# Altium schematic sheet USB2UART.SchDoc
size A4
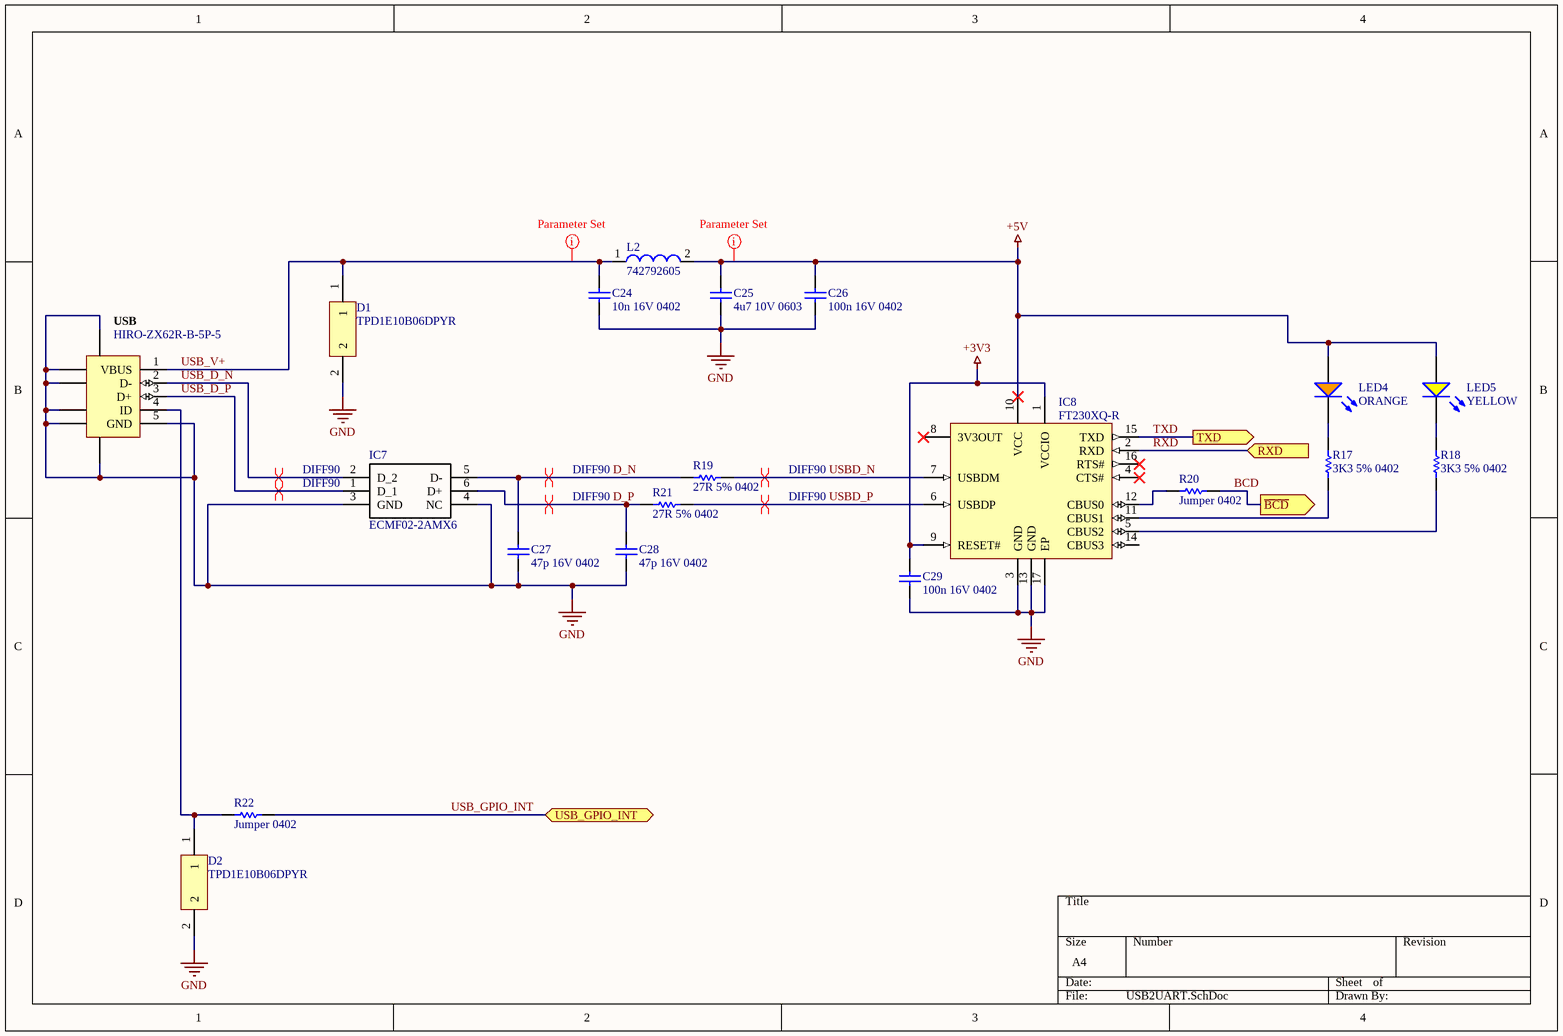
[diagram p0: USB2UART.SchDoc]

## Parts
C24  10n 16V 0402  [CAPC0402(1005)33_L]
C25  4u7 10V 0603  [CAPC0603(1608)100_L]
C26  100n 16V 0402  [CAPC0402(1005)60_L]
C27  47p 16V 0402  [CAPC0402(1005)60_L]
C28  47p 16V 0402  [CAPC0402(1005)60_L]
C29  100n 16V 0402  [CAPC0402(1005)60_N]
D1  TPD1E10B06DPYR  [DPY0002A_M]
D2  TPD1E10B06DPYR  [DPY0002A_M]
IC7  ECMF02-2AMX6  [SON50P150X170X55-6N-D]
IC8  FT230XQ-R  [QFN-16_L]
L2  742792605  [0603(1608)_L]
LED4  ORANGE  [LED_0402]
LED5  YELLOW  [LED_0402]
R17  3K3 5% 0402  [RESC0402(1005)_L]
R18  3K3 5% 0402  [RESC0402(1005)_L]
R19  27R 5% 0402  [RESC0402(1005)_L]
R20  Jumper 0402  [RESC0402(1005)_L]
R21  27R 5% 0402  [RESC0402(1005)_L]
R22  Jumper 0402  [RESC0402(1005)_L]
USB  HIRO-ZX62R-B-5P-5  [HIRO-ZX62R-B-5P_V]

## Ports
RXD (in), TXD (out), USB_GPIO_INT (bidir), ~{BCD} (out)

## Nets
+3V3: C29.2 IC8.1(VCCIO) IC8.9(RESET#)
+5V: C25.2 C26.2 IC8.10(VCC) L2.2 LED4.ANODE LED5.ANODE
GND: C24.1 C25.1 C26.1 C27.1 C28.1 C29.1 D1.2 D2.2 IC7.3(GND) IC7.4(NC) IC8.3(GND) IC8.13(GND) IC8.17(EP) USB.5(GND) USB.6(SHLD) USB.7(SHLD) USB.8(SHLD) USB.9(SHLD) USB.10(SHLD) USB.11(SHLD)
BCD: R20.2 ; port ~{BCD}
D_N: C27.2 IC7.5(D-) R19.1
D_P: C28.2 IC7.6(D+) R21.1
RXD: IC8.2(RXD) ; port RXD
TXD: IC8.15(TXD) ; port TXD
USB_D_N: IC7.2(D_2) USB.2(D-)
USB_D_P: IC7.1(D_1) USB.3(D+)
USB_GPIO_INT: R22.2 ; port USB_GPIO_INT
USB_V+: C24.2 D1.1 L2.1 USB.1(VBUS)
USBD_N: IC8.7(USBDM) R19.2
USBD_P: IC8.6(USBDP) R21.2
NetD2_1: D2.1 R22.1 USB.4(ID)
NetIC8_5: IC8.5(CBUS2) R18.1
NetIC8_11: IC8.11(CBUS1) R17.1
NetIC8_12: IC8.12(CBUS0) R20.1
NetLED4_CATHODE: LED4.CATHODE R17.2
NetLED5_CATHODE: LED5.CATHODE R18.2

Not connected (* = marked no-connect by the designer): IC8 4(CTS#)* 8(3V3OUT)* 14(CBUS3) 16(RTS#)*

## Layout directives
differential pair; net class DIFF90: D_N, D_P, USB_D_N, USB_D_P, USBD_N, USBD_P
rule Width Constraint [Pref Width = 0.254mm    Min Width = 0.254mm    Max Width = 0.5mm]: +5V, USB_V+

## Library data of the parts
C24 = CMP-1034-01875-1: CAP 10nF 16V ±10% 0402 (1005 Metric) Thickness 0.33mm SMD; Case-EIA: 0402; Tolerance: Â±10%; Case-Metric: 1005; Value: 10nF; Max Thickness: 0.33 mm; Rated Voltage: 16 V; Technology: SMT
C25 = CMP-1035-02787-1: CAP 4.7uF 10V ±20% 0603 (1608 Metric) Thickness 1mm SMD; Case-EIA: 0603; Case-Metric: 1608; Tolerance: Â±20%; Value: 4.7uF; Max Thickness: 1 mm; Technology: SMT; Rated Voltage: 10 V
C26 C29 = CMP-1034-02069-1: CAP 100nF 16V ±10% 0402 (1005 Metric) Thickness 0.6mm SMD; Case-EIA: 0402; Case-Metric: 1005; Tolerance: Â±10%; Value: 100nF; Max Thickness: 0.6 mm; Rated Voltage: 16 V; Technology: SMT
C27 C28 = CMP-1034-01081-1: CAP 47pF 16V ±10% 0402 (1005 Metric) Thickness 0.6mm SMD; Case-EIA: 0402; Case-Metric: 1005; Tolerance: Â±10%; Rated Voltage: 16 V; Technology: SMT; Value: 47pF; Max Thickness: 0.6 mm
D1 D2 = CMP-0326-00004-2: ESD in 0402 Package with 10 pF Capacitance and 6 V Breakdown, 1 Channel, -40 to +125 degC, 2-pin X2SON (DPY), Green (RoHS & no Sb/Br); Manufacturer: Texas Instruments; SubFamily: ESD Solution; IEC 61000-4-2 Air-Gap(+/- kV): 30; Eco-Plan: TBD; IO Capacitance(Typ)(pF): 10; Breakdown Voltage(Min)(V): 6; ComponentLink3Description: URL Link1; PackageVersion: revA, Apr-2010; Mounting Technology: Surface Mount; PackageReference: DPY0002A; PackageDescription: 2-Pin Plastic Small Outline No-Lead 1.0 x 0.6 x 0.4 mm Body; ComponentLink2URL: http://www.ti.com/general/docs/lit/getliterature.tsp?genericPartNumber=TPD1E10B06&fileType=pdf; ComponentLink1URL: http://www.ti.com/; ComponentLink3URL: SamplesURL:http://www.ti.com/product/tpd1e10b06#samples; IO Leakage Current(nA): 10; ComponentLink1Description: Manufacturer URL; DatasheetVersion: SLLSEB1; ComponentLink2Description: Datasheet; PartNumber: TPD1E10B06DPYR; IEC 61000-4-2 Contact(+/- kV): 30
IC7 = ECMF02-2AMX6: Integrated Circuit; Manufacturer_Name: STMicroelectronics; Datasheet Link: http://www.st.com/content/ccc/resource/technical/document/datasheet/3a/28/cf/d0/31/63/48/8c/CD00282307.pdf/files/CD00282307.pdf/jcr:content/translations/en.CD00282307.pdf; Height: 0.55mm; Manufacturer_Part_Number: ECMF02-2AMX6; Mouser Part Number: 511-ECMF02-2AMX6; Mouser Price/Stock: https://www.mouser.com/Search/Refine.aspx?Keyword=511-ECMF02-2AMX6; RS Part Number: 8805276; RS Price/Stock: https://uk.rs-online.com/web/p/products/8805276
IC8 = CMP-0248-00010-2: USB to Basic UART Interface Chip, UHCI/OHCI/EHCI Compatible, USB 2.0 Compatible, -40 to +85 degC, 16-Pin QFN, Pb-Free, Tape and Reel; Manufacturer: FTDI; ComponentLink2Description: Datasheet; DatasheetVersion: ver 1.2, Feb-2013; ComponentLink1Description: Manufacturer URL; PackageDescription: 16-Pin Quad Flat No-Lead, 4x4 mm Body, 0.65 mm Pitch; PackageVersion: Feb-13; ComponentLink3URL: www.ftdichip.com/Products/ICs/FT230X.html; Code_JEDEC: MO-220WGGC; RevisionNote: DatasheetVersion updated to 1.2 Feb-2013; ComponentLink1URL: http://www.ftdichip.com/; PackageReference: QFN-16; ComponentLink2URL: http://www.ftdichip.com/Support/Documents/DataSheets/ICs/DS_FT230X.pdf; PartNumber: FT230XQ-R; ComponentLink3Description: FT230X Product Page
L2 = CMP-0220-00044-1: SMD EMI Suppression Ferrite Bead WE-CBF, Z = 33 Ohm; Impedance: 33 Ohm; PackageVersion: 2005; ComponentLink1URL: http://www.we-online.com; ComponentLink1Description: Manufacturer Link; ComponentLink2Description: Datasheet; PackageDescription: Chip Inductor, 2-Leads, Body 2.0 x 1.2 mm; ComponentLink2URL: http://www.we-online.de/katalog/media/pdf/742792012.pdf; PackageReference: SMD-0805; DatasheetVersion: Dec-2005
LED4 LED5 = LED: Generic 0402 LED
R17 R18 = CMP-1011-00086-1: 3K3 0.063W 5% 0402 (1005 Metric)  SMD; Case-EIA: 0402; Value: 3300.00 Ohm; Case-Metric: 1005; Power: 0.063 W; Technology: SMT; Tolerance: 5 %
R19 R21 = CMP-1011-00036-1: 27R 0.063W 5% 0402 (1005 Metric)  SMD; Case-EIA: 0402; Case-Metric: 1005; Value: 27.00 Ohm; Tolerance: 5 %; Power: 0.063 W; Technology: SMT
R20 R22 = CMP-1011-00001-1: Jumper 0402 (1005 Metric); Tolerance: None; Case-Metric: 1005; Case-EIA: 0402; Value: 0.00 Ohm; Power: None; Technology: SMT